# Altium schematic sheet Sheet_MCU_IO.SchDoc: MCU and I/O scheme
size A3; Organization: Altium Limited; Address1: L3, 12a Rodborough Rd; Address2: Frenchs Forest; Address3: NSW; Address4: Australia 2086
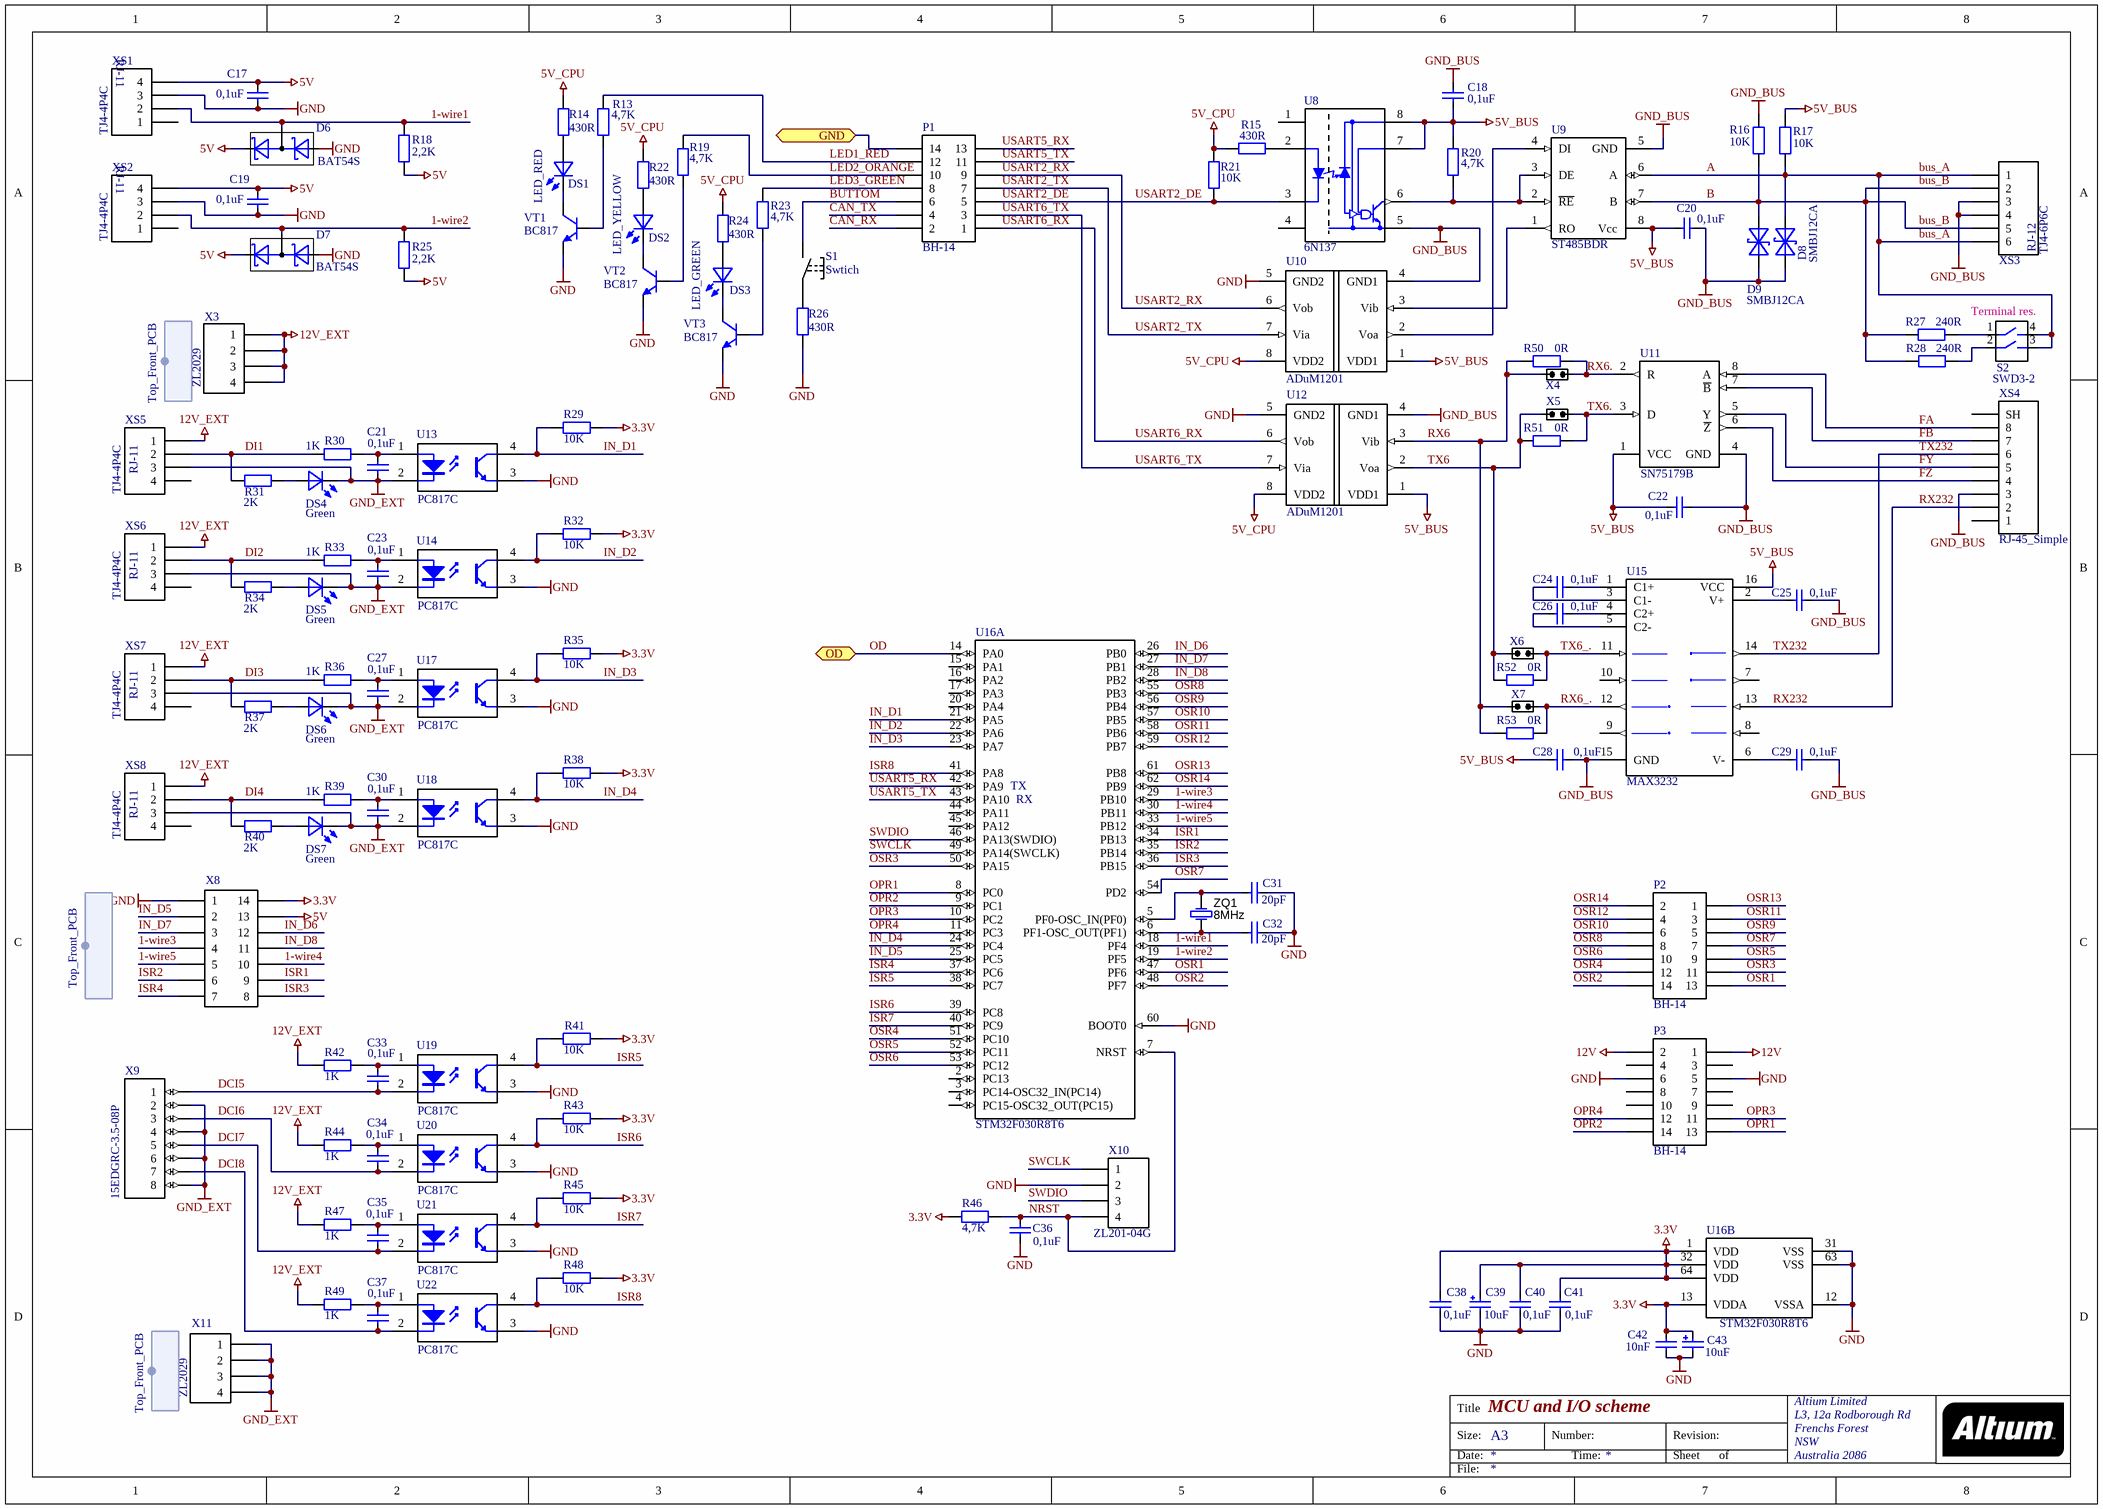
[diagram p0: Sheet_MCU_IO.SchDoc]

## Parts
C17  value 0,1uF  [C_0805]  (hidden comment: Cap_Semi)
C18  value 0,1uF  [C_0805]  (hidden comment: Cap_Semi)
C19  value 0,1uF  [C_0805]  (hidden comment: Cap_Semi)
C20  value 0,1uF  [C_0805]  (hidden comment: Cap_Semi)
C21  value 0,1uF  [C_0805]  (hidden comment: Cap_Semi)
C22  value 0,1uF  [C_0805]  (hidden comment: Cap_Semi)
C23  value 0,1uF  [C_0805]  (hidden comment: Cap_Semi)
C24  value 0,1uF  [C_0805]  (hidden comment: Cap_Semi)
C25  value 0,1uF  [C_0805]  (hidden comment: Cap_Semi)
C26  value 0,1uF  [C_0805]  (hidden comment: Cap_Semi)
C27  value 0,1uF  [C_0805]  (hidden comment: Cap_Semi)
C28  value 0,1uF  [C_0805]  (hidden comment: Cap_Semi)
C29  value 0,1uF  [C_0805]  (hidden comment: Cap_Semi)
C30  value 0,1uF  [C_0805]  (hidden comment: Cap_Semi)
C31  value 20pF  [C_0805]  (hidden comment: Cap_Semi)
C32  value 20pF  [C_0805]  (hidden comment: Cap_Semi)
C33  value 0,1uF  [C_0805]  (hidden comment: Cap_Semi)
C34  value 0,1uF  [C_0805]  (hidden comment: Cap_Semi)
C35  value 0,1uF  [C_0805]  (hidden comment: Cap_Semi)
C36  value 0,1uF  [C_0805]  (hidden comment: Cap_Semi)
C37  value 0,1uF  [C_0805]  (hidden comment: Cap_Semi)
C38  value 0,1uF  [C_0805]  (hidden comment: Cap_Semi)
C39  value 10uF  [5x11]  (hidden comment: Cap_Polar)
C40  value 0,1uF  [C_0805]  (hidden comment: Cap_Semi)
C41  value 0,1uF  [C_0805]  (hidden comment: Cap_Semi)
C42  value 10nF  [C_0805]  (hidden comment: Cap_Semi)
C43  value 10uF  [5x11]  (hidden comment: Cap_Polar)
D6  BAT54S  [SOT-23_d]
D7  BAT54S  [SOT-23_d]
D8  SMBJ12CA  [SMB]
D9  SMBJ12CA  [SMB]
DS1  LED_RED  [LED_RED]
DS2  LED_YELLOW  [LED_YELLOW]
DS3  LED_GREEN  [LED_GREEN]
DS4  Green  [LED_SMD_0805]
DS5  Green  [LED_SMD_0805]
DS6  Green  [LED_SMD_0805]
DS7  Green  [LED_SMD_0805]
P1  BH-14  [BH-14]
P2  BH-14  [BH-14]
P3  BH-14  [BH-14]
R13  value 4,7K  [R_0805]  (hidden comment: Resistor)
R14  value 430R  [R_0805]  (hidden comment: Resistor)
R15  value 430R  [R_0805]  (hidden comment: Resistor)
R16  value 10K  [R_0805]  (hidden comment: Resistor)
R17  value 10K  [R_0805]  (hidden comment: Resistor)
R18  value 2,2K  [R_0805]  (hidden comment: Resistor)
R19  value 4,7K  [R_0805]  (hidden comment: Resistor)
R20  value 4,7K  [R_0805]  (hidden comment: Resistor)
R21  value 10K  [R_0805]  (hidden comment: Resistor)
R22  value 430R  [R_0805]  (hidden comment: Resistor)
R23  value 4,7K  [R_0805]  (hidden comment: Resistor)
R24  value 430R  [R_0805]  (hidden comment: Resistor)
R25  value 2,2K  [R_0805]  (hidden comment: Resistor)
R26  value 430R  [R_0805]  (hidden comment: Resistor)
R27  value 240R  [R_1206]  (hidden comment: Resistor)
R28  value 240R  [R_1206]  (hidden comment: Resistor)
R29  value 10K  [R_0805]  (hidden comment: Resistor)
R30  value 1K  [R_0805]  (hidden comment: Resistor)
R31  value 2K  [R_0805]  (hidden comment: Resistor)
R32  value 10K  [R_0805]  (hidden comment: Resistor)
R33  value 1K  [R_0805]  (hidden comment: Resistor)
R34  value 2K  [R_0805]  (hidden comment: Resistor)
R35  value 10K  [R_0805]  (hidden comment: Resistor)
R36  value 1K  [R_0805]  (hidden comment: Resistor)
R37  value 2K  [R_0805]  (hidden comment: Resistor)
R38  value 10K  [R_0805]  (hidden comment: Resistor)
R39  value 1K  [R_0805]  (hidden comment: Resistor)
R40  value 2K  [R_0805]  (hidden comment: Resistor)
R41  value 10K  [R_0805]  (hidden comment: Resistor)
R42  value 1K  [R_0805]  (hidden comment: Resistor)
R43  value 10K  [R_0805]  (hidden comment: Resistor)
R44  value 1K  [R_0805]  (hidden comment: Resistor)
R45  value 10K  [R_0805]  (hidden comment: Resistor)
R46  value 4,7K  [R_0805]  (hidden comment: Resistor)
R47  value 1K  [R_0805]  (hidden comment: Resistor)
R48  value 10K  [R_0805]  (hidden comment: Resistor)
R49  value 1K  [R_0805]  (hidden comment: Resistor)
R50  value 0R  [R_0805]  (hidden comment: Resistor)
R51  value 0R  [R_0805]  (hidden comment: Resistor)
R52  value 0R  [R_0805]  (hidden comment: Resistor)
R53  value 0R  [R_0805]  (hidden comment: Resistor)
S1  Swtich  [Swich_TACTA-68N-F_]
S2  SW DIP-2  [Swich_DIP2]  (value not drawn)
U8  6N137  [DIP-8]
U9  ST485BDR  [SO-8_N]
U10  ADuM1201  [SO-8_N]
U11  SN75179B  [SO-8_L]
U12  ADuM1201  [SO-8_N]
U13  PC817C  [DIP-4]
U14  PC817C  [DIP-4]
U15  MAX3232  [SO-16_N]
U16  STM32F030R8T6  [LQFP64_L]  (parts A,B of 2)
U17  PC817C  [DIP-4]
U18  PC817C  [DIP-4]
U19  PC817C  [DIP-4]
U20  PC817C  [DIP-4]
U21  PC817C  [DIP-4]
U22  PC817C  [DIP-4]
VT1  BC817  [SOT-23_N]
VT2  BC817  [SOT-23_N]
VT3  BC817  [SOT-23_N]
X3  ZL2029  [PLS-4-3D]
X4  JMP  [PLS-2-2]  (value not drawn)
X5  JMP  [PLS-2-2]  (value not drawn)
X6  JMP  [PLS-2-2]  (value not drawn)
X7  JMP  [PLS-2-2]  (value not drawn)
X8  PLS2-14  [PLS2-14]  (value not drawn)
X9  15EDGRC-3.5-08P  [MC_3.5_8]
X10  PLS-4  [PLS-4-3D]  (value not drawn)
X11  PLS-4  [PLS-4-3D]  (value not drawn)
XS1  RJ-11  [RJ-11 - TJ4-4P4C]  (value not drawn)
XS2  RJ-11  [RJ-11 - TJ4-4P4C]  (value not drawn)
XS3  RJ-12  [RJ-12 - TJ4-6P6C]  (value not drawn)
XS4  RJ-45_Simple  [RJ-45 - TJ4-8P8C]
XS5  RJ-11  [RJ-11 - TJ4-4P4C]  (value not drawn)
XS6  RJ-11  [RJ-11 - TJ4-4P4C]  (value not drawn)
XS7  RJ-11  [RJ-11 - TJ4-4P4C]  (value not drawn)
XS8  RJ-11  [RJ-11 - TJ4-4P4C]  (value not drawn)
ZQ1  8MHz  [HC49S_3D]

## Ports
GND, OD

## Harnesses
Top_Front_PCB: 

## Nets
3.3V: C38.1 C39.1 C40.1 C41.1 C42.1 C43.1 R29.1 R32.1 R35.1 R38.1 R41.1 R43.1 R45.1 R46.1 R48.1 U16.1(VDD) U16.13(VDDA) U16.32(VDD) U16.64(VDD) X8.14
5V: C17.1 C19.1 D6.2(C) D7.2(C) R18.2 R25.2 X8.13 XS1.4 XS2.4
5V_BUS: C18.1 C20.2 C22.2 C28.2 R17.2 R20.2 U8.7(Ve) U8.8(Vcc) U9.8(Vcc) U10.1(VDD1) U11.1(VCC) U12.1(VDD1) U15.16(VCC)
5V_CPU: R14.1 R15.2 R21.2 R22.1 R24.1 U10.8(VDD2) U12.8(VDD2)
12V: P3.1 P3.2
12V_EXT: R42.2 R44.2 R47.2 R49.2 X3.1 X3.2 X3.3 X3.4 XS5.1 XS6.1 XS7.1 XS8.1
GND: C17.2 C19.2 C31.1 C32.1 C36.2 C38.2 C39.2 C40.2 C41.2 C42.2 C43.2 D6.1(A) D7.1(A) P3.5 P3.6 R26.2 U10.5(GND2) U12.5(GND2) U13.3(E) U14.3(E) U16.12(VSSA) U16.31(VSS) U16.60(BOOT0) U16.63(VSS) U17.3(E) U18.3(E) U19.3(E) U20.3(E) U21.3(E) U22.3(E) VT1.2(E) VT2.2(E) VT3.2(E) X8.1 X10.2 XS1.3 XS2.3
GND_BUS: C18.2 C20.1 C22.1 C25.1 C28.1 C29.1 D8.1(A) D9.2(C) R16.2 U8.5(GND) U9.5(GND) U10.4(GND1) U11.4(GND) U12.4(GND1) U15.15(GND) XS3.3 XS3.4 XS4.3
GND_EXT: C21.2 C23.2 C27.2 C30.2 DS4.2(C) DS5.2(C) DS6.2(C) DS7.2(C) U13.2(K) U14.2(K) U17.2(K) U18.2(K) X9.2 X9.4 X9.6 X9.8 X11.1 X11.2 X11.3 X11.4 XS5.3 XS6.3 XS7.3 XS8.3
1-wire1: D6.3(CA) R18.1 U16.18(PF4) XS1.2
1-wire2: D7.3(CA) R25.1 U16.19(PF5) XS2.2
1-wire3: U16.29(PB10) X8.4
1-wire4: U16.30(PB11) X8.10
1-wire5: U16.33(PB12) X8.5
A: D8.2(C) R17.1 S2.3 S2.4 U9.6(A) XS3.1 XS3.6  [also labelled bus_A]
B: D9.1(A) R16.1 R27.1 R28.1 U9.7(B) XS3.2 XS3.5  [also labelled bus_B]
BUTTOM: P1.6 S1.2(NO)
CAN_RX: P1.2
CAN_TX: P1.4
DCI5: C33.2 U19.2(K) X9.1
DCI6: C34.2 U20.2(K) X9.3
DCI7: C35.2 U21.2(K) X9.5
DCI8: C37.2 U22.2(K) X9.7
DI1: R30.2 R31.2 XS5.2
DI2: R33.2 R34.2 XS6.2
DI3: R36.2 R37.2 XS7.2
DI4: R39.2 R40.2 XS8.2
FA: U11.8(A) XS4.8
F~{B}: U11.7(~{B}) XS4.7
FY: U11.5(Y) XS4.5
F~{Z}: U11.6(~{Z}) XS4.4
GND: P1.14 ; port GND  [a separate net that carries the same name]
IN_D1: R29.2 U13.4(C) U16.21(PA5)
IN_D2: R32.2 U14.4(C) U16.22(PA6)
IN_D3: R35.2 U16.23(PA7) U17.4(C)
IN_D4: R38.2 U16.24(PC4) U18.4(C)
IN_D5: U16.25(PC5) X8.2
IN_D6: U16.26(PB0) X8.12
IN_D7: U16.27(PB1) X8.3
IN_D8: U16.28(PB2) X8.11
ISR1: U16.34(PB13) X8.9
ISR2: U16.35(PB14) X8.6
ISR3: U16.36(PB15) X8.8
ISR4: U16.37(PC6) X8.7
ISR5: R41.2 U16.38(PC7) U19.4(C)
ISR6: R43.2 U16.39(PC8) U20.4(C)
ISR7: R45.2 U16.40(PC9) U21.4(C)
ISR8: R48.2 U16.41(PA8) U22.4(C)
LED1_RED: P1.12 R13.2
LED2_ORANGE: P1.10 R19.2
LED3_GREEN: P1.8 R23.2
NRST: C36.1 R46.2 U16.7(NRST) X10.4
OD: U16.14(PA0) ; port OD
OPR1: P3.13 U16.8(PC0)
OPR2: P3.14 U16.9(PC1)
OPR3: P3.11 U16.10(PC2)
OPR4: P3.12 U16.11(PC3)
OSR1: P2.13 U16.47(PF6)
OSR2: P2.14 U16.48(PF7)
OSR3: P2.11 U16.50(PA15)
OSR4: P2.12 U16.51(PC10)
OSR5: P2.9 U16.52(PC11)
OSR6: P2.10 U16.53(PC12)
OSR7: P2.7 U16.54(PD2)
OSR8: P2.8 U16.55(PB3)
OSR9: P2.5 U16.56(PB4)
OSR10: P2.6 U16.57(PB5)
OSR11: P2.3 U16.58(PB6)
OSR12: P2.4 U16.59(PB7)
OSR13: P2.1 U16.61(PB8)
OSR14: P2.2 U16.62(PB9)
RX6: R50.2 R53.2 U12.3(Vib) X4.1 X7.1
RX6.: R50.1 U11.2(R) X4.2
RX6_.: R53.1 U15.12(R1OUT) X7.2
RX232: U15.13(R1IN) XS4.2
SWCLK: U16.49(PA14(SWCLK)) X10.1
SWDIO: U16.46(PA13(SWDIO)) X10.3
TX6: R51.2 R52.2 U12.2(Voa) X5.1 X6.1
TX6.: R51.1 U11.3(D) X5.2
TX6_.: R52.1 U15.11(T1IN) X6.2
TX232: U15.14(T1OUT) XS4.6
USART2_DE: P1.5 R21.1 U8.3(C)
USART2_RX: P1.9 U10.6(Vob)
USART2_TX: P1.7 U10.7(Via)
USART5_RX: P1.13 U16.42(PA9)
USART5_TX: P1.11 U16.43(PA10)
USART6_RX: P1.1 U12.6(Vob)
USART6_TX: P1.3 U12.7(Via)
NetC21_1: C21.1 R30.1 U13.1(A)
NetC23_1: C23.1 R33.1 U14.1(A)
NetC24_1: C24.1 U15.1(C1+)
NetC24_2: C24.2 U15.3(C1-)
NetC25_2: C25.2 U15.2(V+)
NetC26_1: C26.1 U15.4(C2+)
NetC26_2: C26.2 U15.5(C2-)
NetC27_1: C27.1 R36.1 U17.1(A)
NetC29_2: C29.2 U15.6(V-)
NetC30_1: C30.1 R39.1 U18.1(A)
NetC31_2: C31.2 U16.5(PF0-OSC_IN(PF0)) ZQ1.2(OSC2)
NetC32_2: C32.2 U16.6(PF1-OSC_OUT(PF1)) ZQ1.1(OSC1)
NetC33_1: C33.1 R42.1 U19.1(A)
NetC34_1: C34.1 R44.1 U20.1(A)
NetC35_1: C35.1 R47.1 U21.1(A)
NetC37_1: C37.1 R49.1 U22.1(A)
NetDS1_1: DS1.1(A) R14.2
NetDS1_2: DS1.2(C) VT1.3(C)
NetDS2_1: DS2.1(A) R22.2
NetDS2_2: DS2.2(C) VT2.3(C)
NetDS3_1: DS3.1(A) R24.2
NetDS3_2: DS3.2(C) VT3.3(C)
NetDS4_1: DS4.1(A) R31.1
NetDS5_1: DS5.1(A) R34.1
NetDS6_1: DS6.1(A) R37.1
NetDS7_1: DS7.1(A) R40.1
NetR13_1: R13.1 VT1.1(B)
NetR15_1: R15.1 U8.2(A)
NetR19_1: R19.1 VT2.1(B)
NetR20_1: R20.1 U8.6(Vo) U9.2(~{RE}) U9.3(DE)
NetR23_1: R23.1 VT3.1(B)
NetR26_1: R26.1 S1.1(COMMON)
NetR27_2: R27.2 S2.1
NetR28_2: R28.2 S2.2
NetU9_1: U9.1(RO) U10.3(Vib)
NetU9_4: U9.4(DI) U10.2(Voa)

Not connected (* = marked no-connect by the designer): P3 3 4 7 8 9 10; U8 1(NC) 4(NC); U15 7(T2OUT) 8(R2IN) 9(R2OUT) 10(T2IN); U16 2(PC13) 3(PC14-OSC32_IN(PC14)) 4(PC15-OSC32_OUT(PC15)) 15(PA1) 16(PA2) 17(PA3) 20(PA4) 44(PA11) 45(PA12); XS1 1; XS2 1; XS4 1 13(SH); XS5 4; XS6 4; XS7 4; XS8 4

## Notes on the sheet
- (near S2) Terminal res.
- (near U16) TX
- (near U16) RX
- Title
- Size:
- Date:
- A3
- Number:
- Time:
- Revision:
- Sheet
- of
- File:
- (in symbol SW DIP-2) SWD3-2

## Library data of the parts
C17-C38 C40-C42 = Cap_Semi: Capacitor semi
C39 C43 = Capacitor Polar
D6 D7 = BAT54S: Diode Schottky
D8 D9 = SMBJ12CA: Supressor
DS1 = LED_RED: LED
DS2 = LED_YELLOW: LED
DS3 = LED_GREEN: LED
DS4-DS7 = LED: LED_SMD
P1-P3 = BH-14: IDC/BH; LatestRevisionDate: 17-Jul-2002; LatestRevisionNote: Re-released for DXP Platform.; Publisher: Altium Limited
S2 = SW DIP-2: DIP Switch_2
U8 = 6N137: Optocoupler
U9 = ST485BDR: RS-485/RS-422 Transceiver
U10 U12 = ADuM1201: Dual-Channel Digital Isolators
U11 = SN75179B: RS485/RS422 Differential driver and receiver pair
U13 U14 U17-U22 = PC817: Optocoupler
U15 = MAX3232: RS-232 Transceiver; Published: 16-Jan-2001; LatestRevisionDate: 29-May-2009; LatestRevisionNote: IPC-7351 Footprint Added.; DatasheetVersion: Mar-1999; PackageVersion: 21-0066 C; PackageReference: TSSOP16; Publisher: Altium Limited; PackageDescription: 16-Pin Thin Small Outline Package 0.65 mm Pitch; ComponentLink1Description: Manufacturer Link; ComponentLink1URL: http://www.maxim-ic.com/; ComponentLink2Description: Datasheet; ComponentLink2URL: http://pdfserv.maxim-ic.com/en/ds/MAX3222-MAX3241.pdf
U16 = STM32F030R8T6: ARM Cortex-M0 32-bit MCU, 64 KB Flash, 8 KB Internal RAM, 55 I/Os, 64-pin LQFP, -40 to 85 degC, Tray
VT1-VT3 = BC817: NPN
X3 = PLS-4: Header, 4-Pin; LatestRevisionDate: 17-Jul-2002; LatestRevisionNote: Re-released for DXP Platform.; Publisher: Altium Limited
X4-X7 = JMP: Jumper; LatestRevisionDate: 17-Jul-2002; LatestRevisionNote: Re-released for DXP Platform.; Publisher: Altium Limited
X8 = PLS2-14: Header, 14-Pin
X9 = MC_3.5_8: Connector 3.5mm
X10 = PLS-4: ZL201-04G; LatestRevisionDate: 17-Jul-2002; LatestRevisionNote: Re-released for DXP Platform.; Publisher: Altium Limited
X11 = PLS-4: ZL2029; LatestRevisionDate: 17-Jul-2002; LatestRevisionNote: Re-released for DXP Platform.; Publisher: Altium Limited
XS1 XS2 XS5-XS8 = RJ-11: TJ4-4P4C
XS3 = RJ-12: TJ4-6P6C
XS4 = RJ-45_Simple: Connector RJ-45 Simple
ZQ1 = XTAL: Crystal Oscillator; Published: 8-Jun-2000; LatestRevisionDate: 17-Jul-2002; LatestRevisionNote: Re-released for DXP Platform.; PackageReference: R38; Publisher: Altium Limited